# EAGLE design nabijecka_pb (EAGLE 7.1.0)
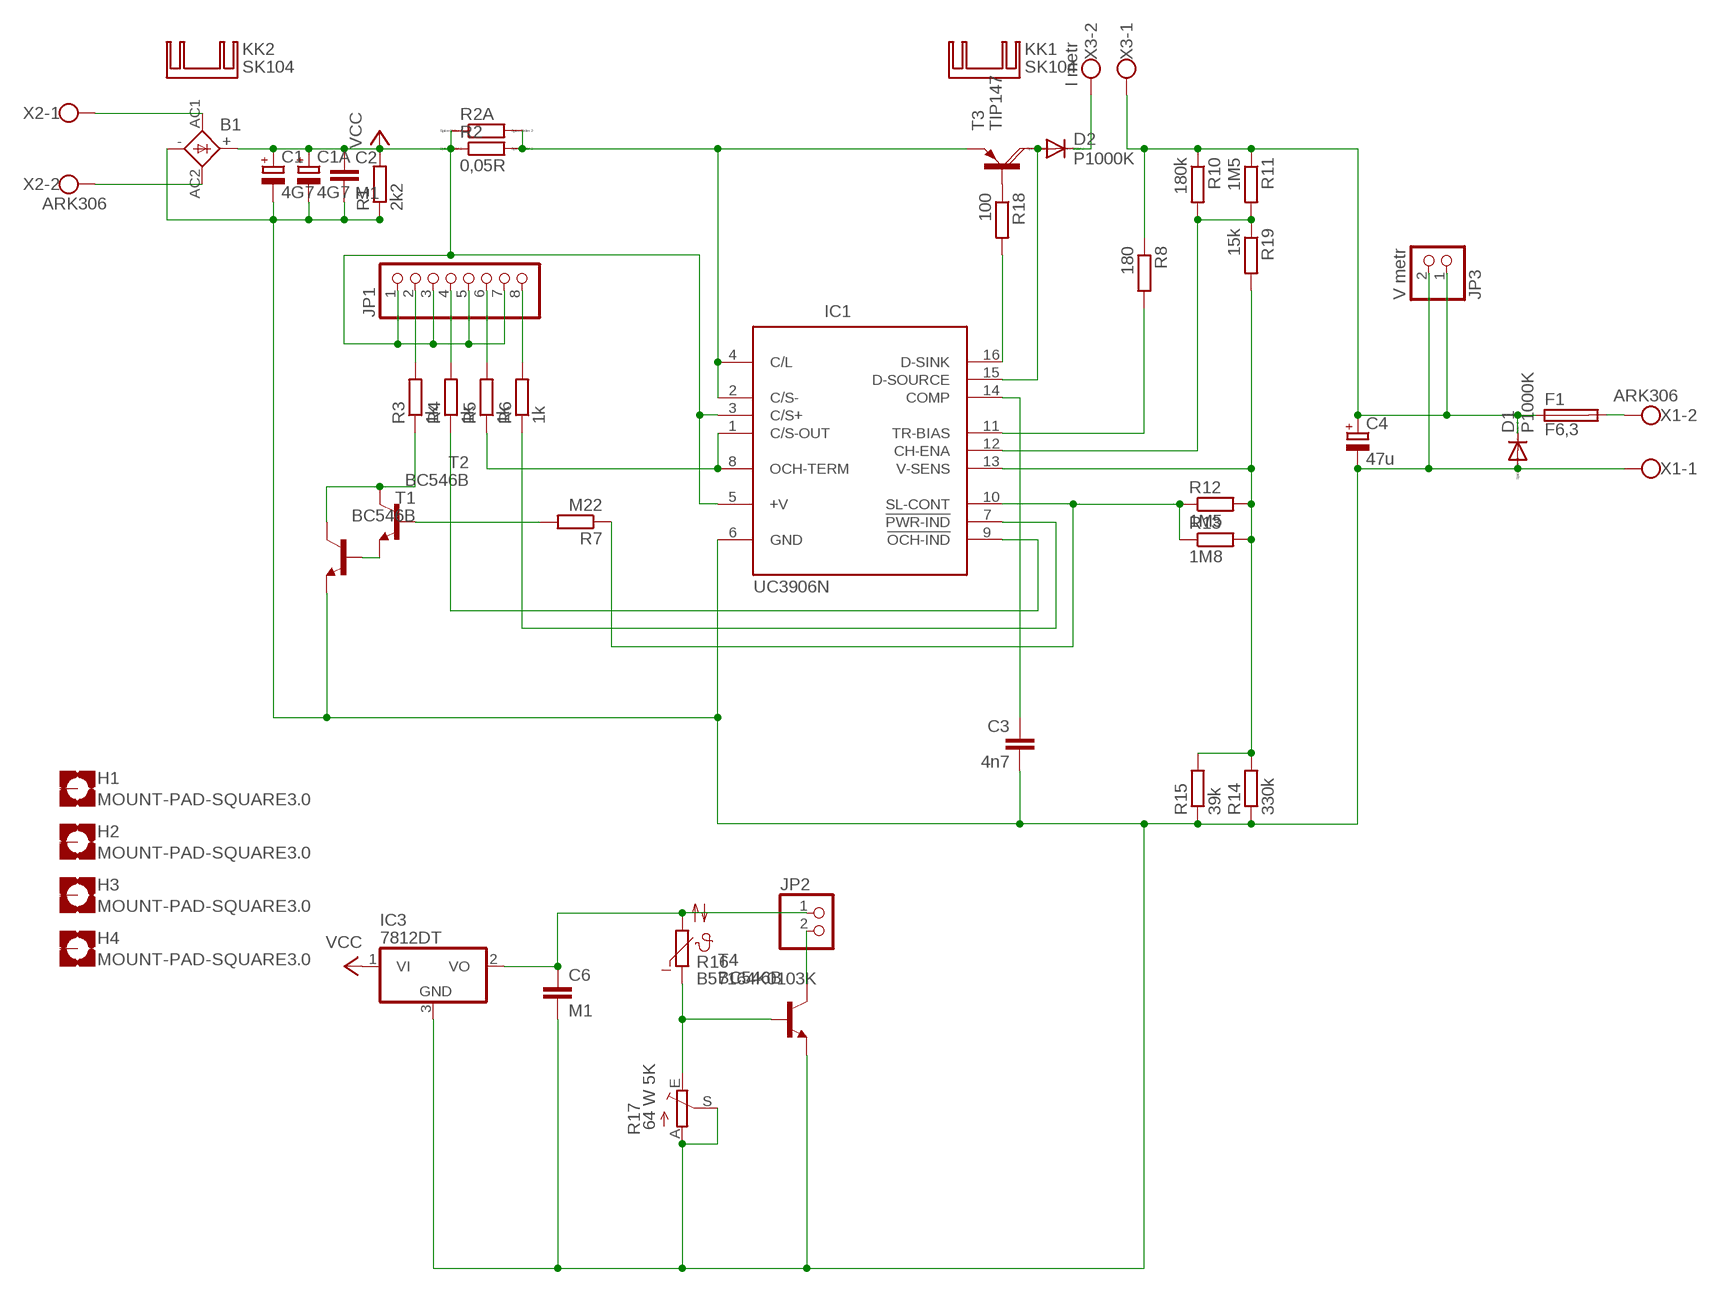
[diagram p0: schematic, sheet 1]

## Parts
B1  FB32  [FB32]
C1  4G7  CPOL-EUE7.5-18  [E7,5-18]
C1A  4G7  CPOL-EUE7.5-18  [E7,5-18]
C2  M1  C-EU050-045X075  [C050-045X075]
C3  4n7  C-EU050-045X075  [C050-045X075]
C4  47u  CPOL-EUE2.5-6  [E2,5-6]
C6  M1  C-EUC1206  [C1206]
D1  P1000K  P600  [P6-15]
D2  P1000K  P600  [P6-15]
F1  F6,3  FUSEF456  [F456]
H1  MOUNT-PAD-SQUARE3.0  [3,0-PAD-SQUARE]
H2  MOUNT-PAD-SQUARE3.0  [3,0-PAD-SQUARE]
H3  MOUNT-PAD-SQUARE3.0  [3,0-PAD-SQUARE]
H4  MOUNT-PAD-SQUARE3.0  [3,0-PAD-SQUARE]
IC1  UC3906N  [DIL16]
IC3  7812DT  [TO252]
JP1  PINHD-1X8  [1X08]
JP2  PINHD-1X2  [1X02]
JP3  V metr  PINHD-1X2  [1X02]
KK1  SK104  [SK104]
KK2  SK104  [SK104]
R1  2k2  R-EU_0207/10  [0207/10]
R2  0,05R  R-EU_0817_22  [P0817/22]
R2A  R-EU_0817_22  [P0817/22]
R3  1k  R-EU_0207/10  [0207/10]
R4  1k  R-EU_0207/10  [0207/10]
R5  1k  R-EU_0207/10  [0207/10]
R6  1k  R-EU_0207/10  [0207/10]
R7  M22  R-EU_0207/10  [0207/10]
R8  180  R-EU_0207/10  [0207/10]
R10  180k  R-EU_0207/10  [0207/10]
R11  1M5  R-EU_0207/10  [0207/10]
R12  1M5  R-EU_0207/10  [0207/10]
R13  1M8  R-EU_0207/10  [0207/10]
R14  330k  R-EU_0207/10  [0207/10]
R15  39k  R-EU_0207/10  [0207/10]
R16  B57164K0103K  NTC642-6  [P642]
R17  64 W 5K  TRIM_EU-S64W  [S64W]
R18  100  R-EU_0207/10  [0207/10]
R19  15k  R-EU_0207/10  [0207/10]
T1  BC546B  [TO92-EBC]
T2  BC546B  [TO92-EBC]
T3  TIP147  [SOT93]
T4  BC546B  [TO92-EBC]
X1  ARK306  W237-102  [W237-102]
X2  ARK306  W237-102  [W237-102]
X3  I metr  W237-102  [W237-102]

## Nets
N$1: B1.AC1 X2.1
N$2: B1.AC2 X2.2
N$3: F1.2 X1.2
N$4: IC1.2(C/S-) IC1.4(C/L) R2.2 R2A.2 T3.E
N$5: JP1.4 R4.2
N$6: JP1.2 R3.2
N$7: D2.A IC1.15(D-SOURCE) T3.C
N$8: JP1.6 R5.2
N$9: JP1.8 R6.2
N$10: R3.1 T1.C T2.C
N$11: R7.2 T2.B
N$12: IC1.7(!PWR-IND) R6.1
N$13: IC1.1(C/S-OUT) IC1.8(OCH-TERM) R5.1
N$14: IC1.9(!OCH-IND) R4.1
N$15: T1.B T2.E
N$16: IC1.10(SL-CONT) R7.1 R12.1 R13.1
N$17: R18.1 T3.B
N$18: C4.+ D1.C F1.1 JP3.1 R8.1 R10.1 R11.1 X3.1
N$19: D2.C X3.2
N$20: C3.1 IC1.14(COMP)
N$21: IC1.11(TR-BIAS) R8.2
N$23: IC1.12(CH-ENA) R10.2 R11.2 R19.1
N$24: IC1.13(V-SENS) R12.2 R13.2 R14.2 R15.2 R19.2
N$25: R16.1 R17.E T4.B
N$26: C6.1 IC3.2(VO) JP2.1 R16.2
N$28: B1.- C1.- C1A.- C2.2 C3.2 C4.- C6.2 D1.A IC1.6(GND) IC3.3(GND) JP3.2 R1.1 R14.1 R15.1 R17.A R17.S T1.E T4.E X1.1
N$29: IC1.16(D-SINK) R18.2
N$30: JP2.2 T4.C
VCC: B1.+ C1.+ C1A.+ C2.1 IC1.3(C/S+) IC1.5(+V) IC3.1(VI) JP1.1 JP1.3 JP1.5 JP1.7 R1.2 R2.1 R2A.1
Unconnected: H1.B3,0(MOUNT) H2.B3,0(MOUNT) H3.B3,0(MOUNT) H4.B3,0(MOUNT)

## Library data of the parts
B1 = rectifier:FB32: FAGOR RECTIFIER grid 1 x 10,2 x 7,5 mm
C1 C1A C4 = rcl:CPOL-EU: POLARIZED CAPACITOR, European symbol
C2 C3 C6 = rcl:C-EU: CAPACITOR, European symbol
D1 D2 = diode:P600: DIODE high voltage diode, silicon rectifier 1.0 A to 6.0 A, 50 V to 1300 V http://www.kosemi.com/product/diosr.html
F1 = fuse:FUSE: Fuse; OC_FARNELL: unknown; OC_NEWARK: unknown
H1-H4 = holes:MOUNT-PAD-SQUARE: MOUNTING PAD, square
IC1 = unitrode:UC3906: Sealed Lead-Acid Battery Charger
IC3 = linear:78*: Positive VOLTAGE REGULATOR Source: http://cache.national.com/ds/LM/LM78L05.pdf http://www.fairchildsemi.com/ds/LM/LM7805.pdf
JP1 = pinhead:PINHD-1X8: PIN HEADER
JP2 JP3 = pinhead:PINHD-1X2: PIN HEADER
KK1 KK2 = heatsink:SK104: HEATSINK manufacturer Fischer/distributor Buerklin
R1 R3-R8 R10-R15 R18 R19 = rcl:R-EU_: RESISTOR, European symbol
R2 R2A = resistor:R-EU_: RESISTOR, European symbol; SPICEPREFIX: R
R16 = ptc-ntc:NTC642-6: PHILIPS NTC; OC_FARNELL: unknown; OC_NEWARK: unknown
R17 = pot:TRIM_EU-: POTENTIOMETER
T1 T2 T4 = transistor-npn:BC546*: NPN Transistor
T3 = transistor-power:TIP147: PNP DARLINGTON TRANSISTOR
X1-X3 = con-wago-500:W237-102: WAGO SCREW CLAMP; MPN: 237-102; OC_FARNELL: unknown; OC_NEWARK: 70K9898

## Board
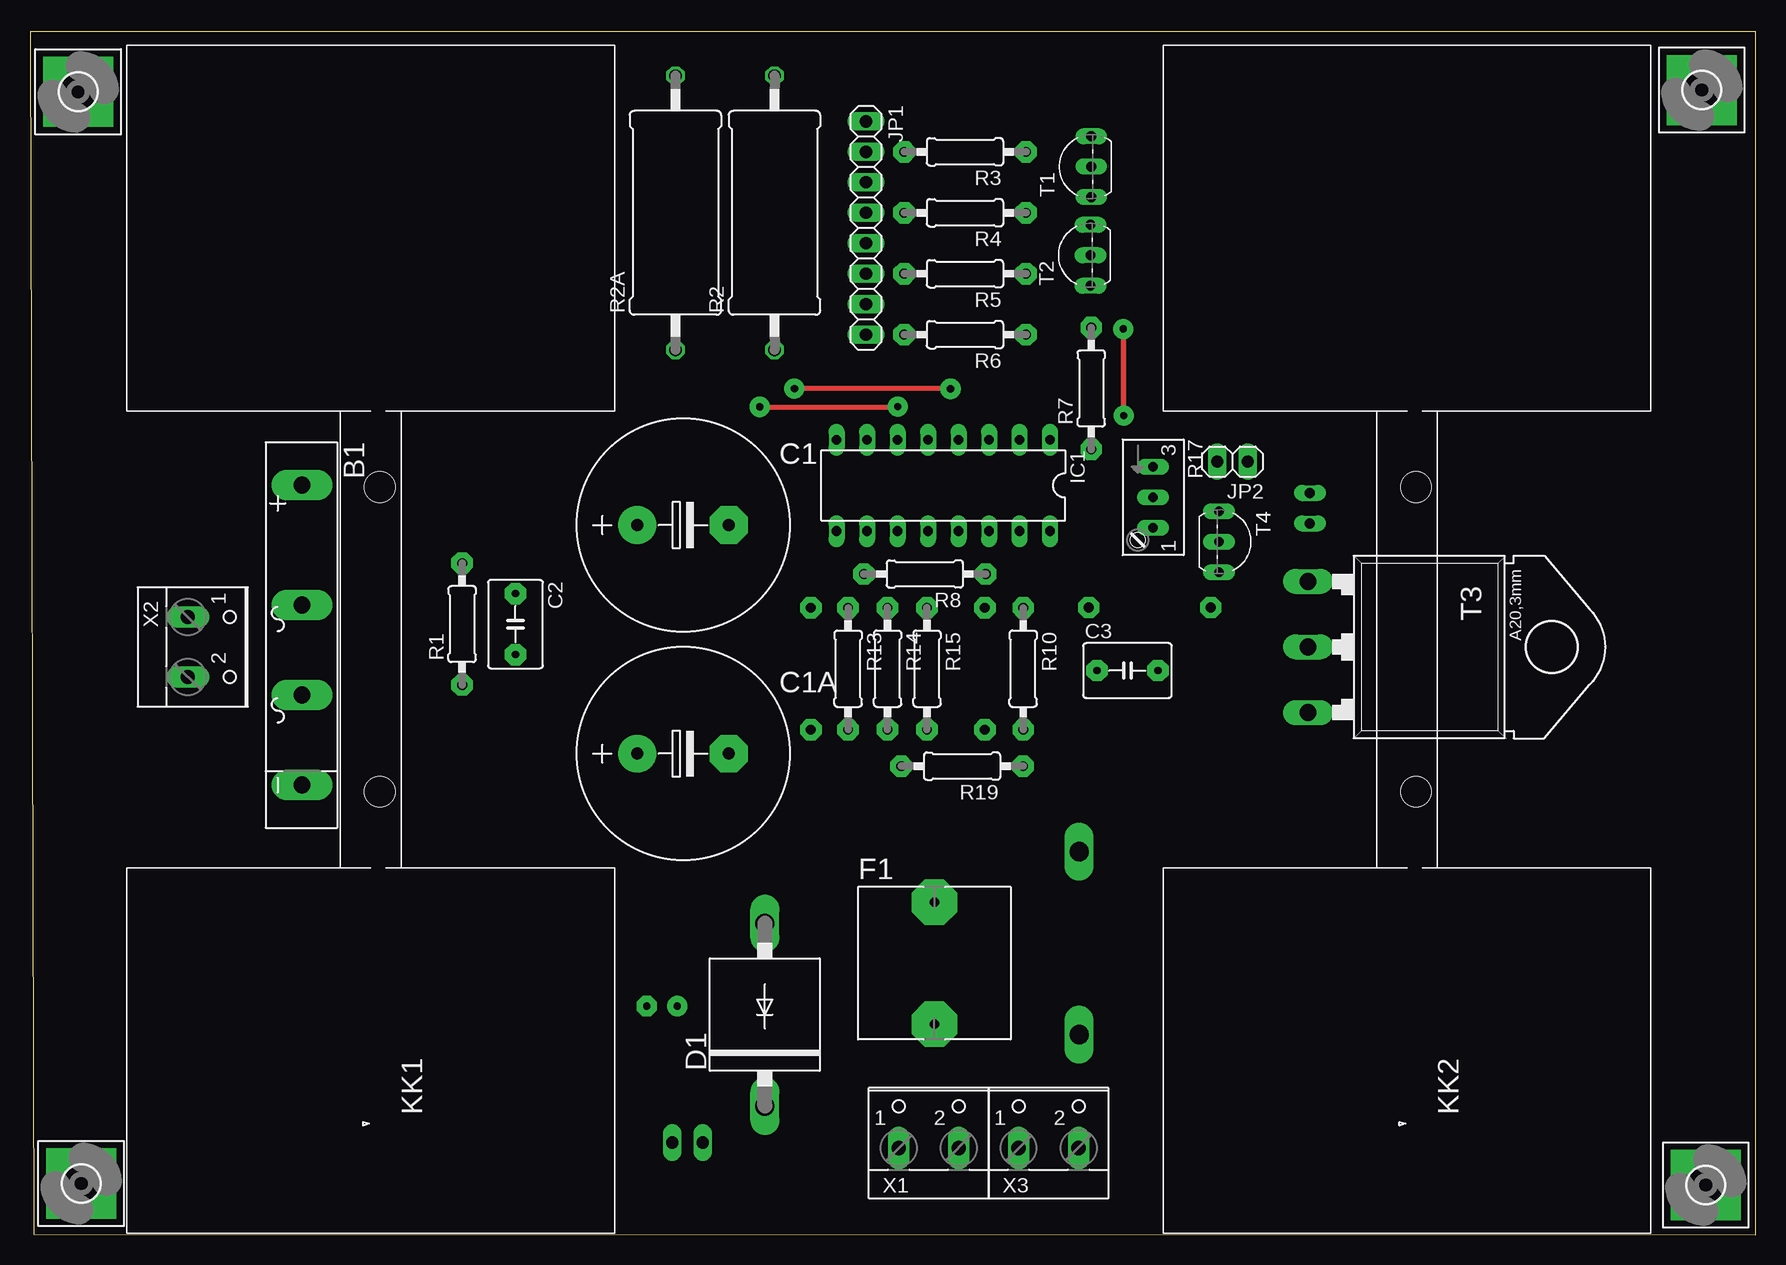
[diagram p1: board, top side]
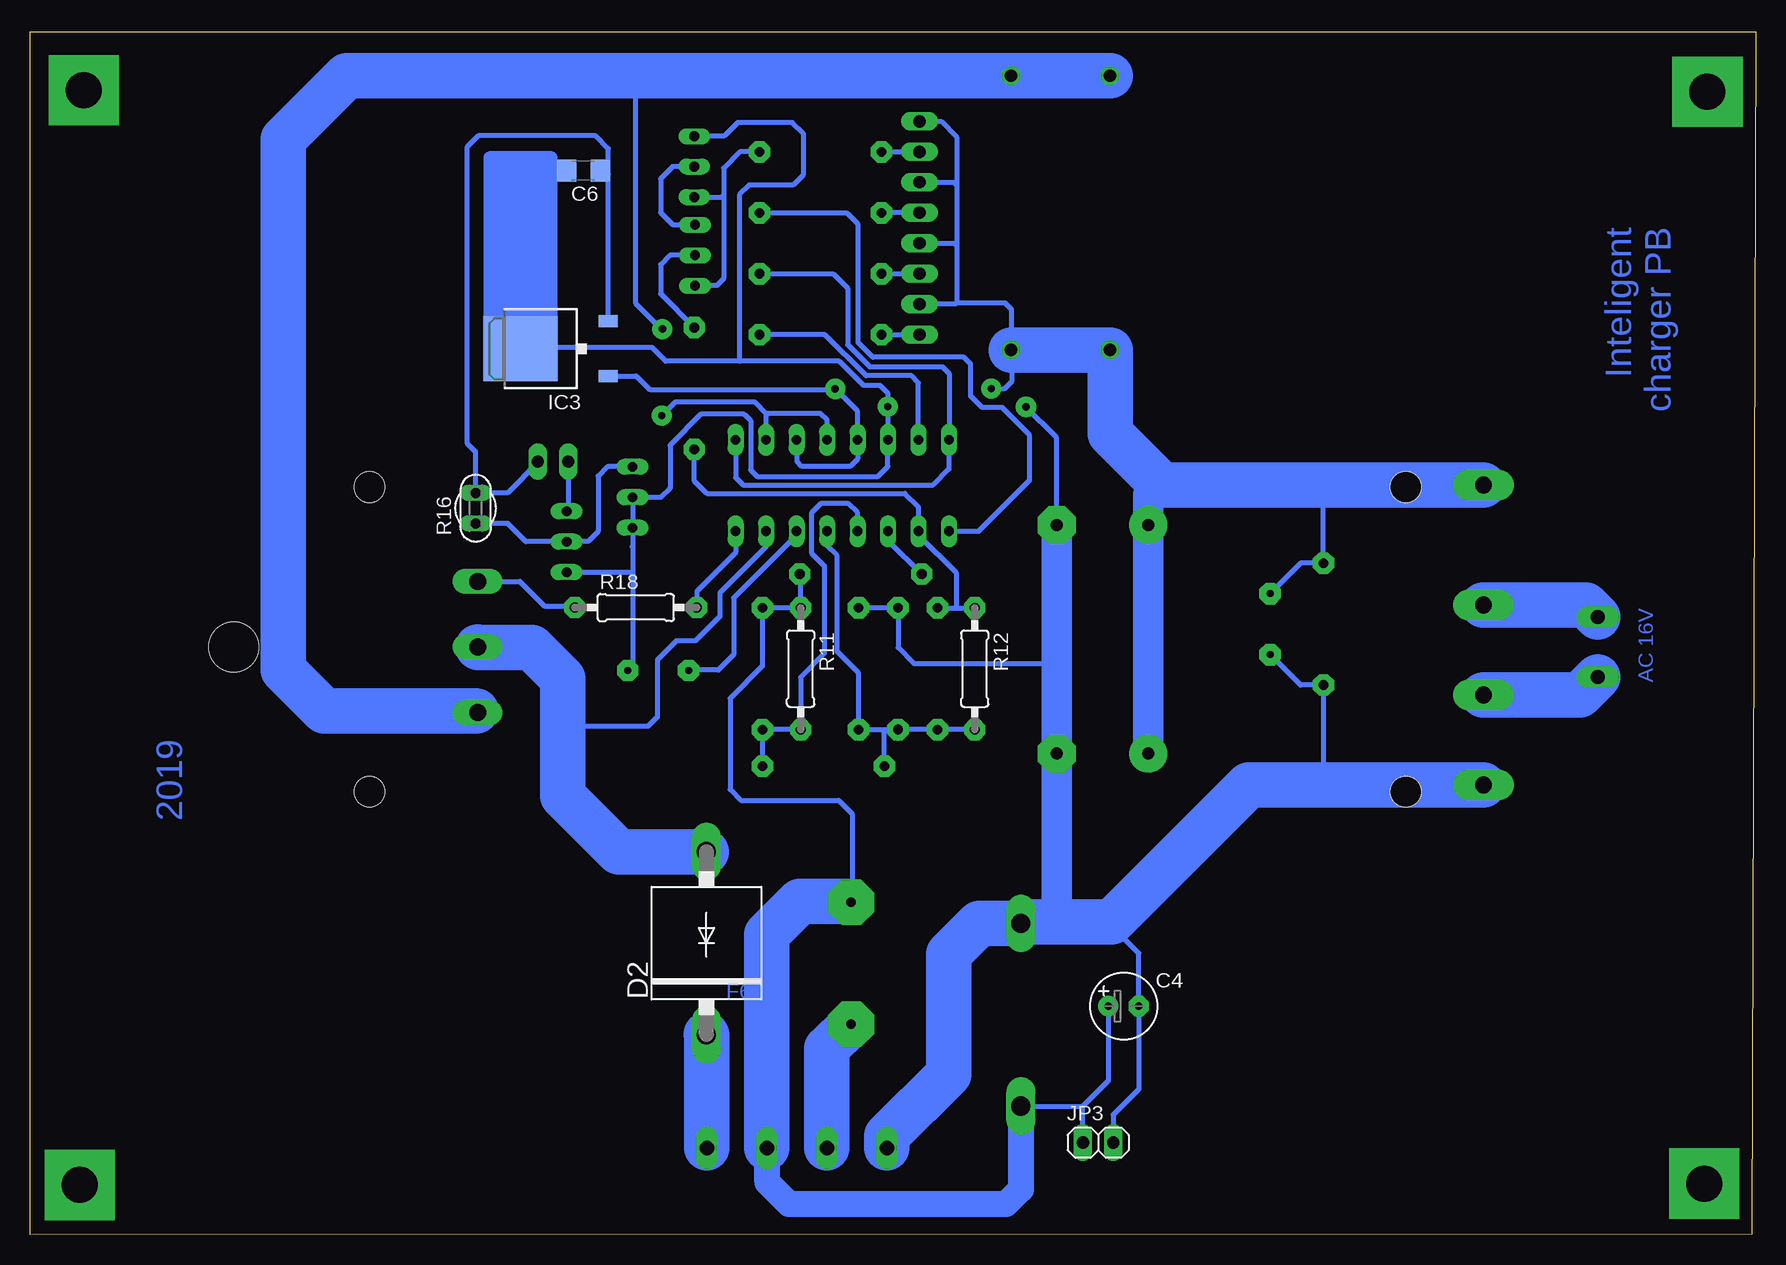
[diagram p2: board, bottom side, seen from below]

Size 143.8 x 100.31 mm. Coordinates in mm from the lower left corner, seen from the top.
Outline: 0.3,0.06 143.8,0 143.8,100.31 0,100.31 0.3,0.06
Copper layers (1*16): Top 0.035mm / dielectric 1.5mm / Bottom 0.035mm
Design rules "default": minimum track width 10mil, minimum drill 24mil, track to track 8mil, track to pad 8mil, pad to pad 8mil, via to via 8mil, smd to smd 8mil, copper to edge 40mil, drill to drill 8mil, minimum pad ring 10mil, minimum via ring 8mil, stop-mask expansion 4mil, vias tented up to drill 0mil, thermal gap 10mil

### Footprints (pad centres in the part's own frame; a part is rotated, then mirrored left to right if it is on the bottom)
FB32 = drill 1.397 pad 2.54 long: + -13.5,0; - 11.494,0; AC1 -3.492,0; AC2 4.001,0
E7,5-18 = drill 1.016 pad 3.15: + -3.81,0 | drill 1.016 pad 3.15 octagon: - 3.81,0
C050-045X075 = drill 0.6 pad 1.778 octagon: 1 -2.54,0; 2 2.54,0
E2,5-6 = drill 0.6 pad 1.676: + -1.27,0 | drill 0.6 pad 1.676 octagon: - 1.27,0
C1206 = smd 1.6 x 1.8: 1 -1.4,0; 2 1.4,0
P6-15 = drill 1.6 long: A 7.62,0; C -7.62,0
F456 = drill 0.8 pad 3.81 octagon: 1 0,5.08; 2 0,-5.08
3,0-PAD-SQUARE = drill 3 pad 5.842 square: B3,0 0,0
DIL16 = drill 0.813 long: 1 -8.89,-3.81; 2 -6.35,-3.81; 3 -3.81,-3.81; 4 -1.27,-3.81; 5 1.27,-3.81; 6 3.81,-3.81; 7 6.35,-3.81; 8 8.89,-3.81; 9 8.89,3.81; 10 6.35,3.81; 11 3.81,3.81; 12 1.27,3.81; 13 -1.27,3.81; 14 -3.81,3.81; 15 -6.35,3.81; 16 -8.89,3.81
TO252 = smd 1 x 1.6: 1 -2.28,-4.8; 2 2.28,-4.8 | smd 5.4 x 6.2: 3 0,2.5
1X08 = drill 1.016 long: 1 -8.89,0; 2 -6.35,0; 3 -3.81,0; 4 -1.27,0; 5 1.27,0; 6 3.81,0; 7 6.35,0; 8 8.89,0
1X02 = drill 1.016 long: 1 -1.27,0; 2 1.27,0
SK104 = hole 2.54: -12.7,-0.762; 12.7,-0.762
0207/10 = drill 0.813 pad 1.778 octagon: 1 -5.08,0; 2 5.08,0
P0817/22 = drill 1.016 octagon: 1 -11.43,0; 2 11.43,0
P642 = drill 0.813 long: 1 -1.27,0; 2 1.27,0
S64W = drill 0.813 long: A 2.54,1.27; E -2.54,1.27; S 0,1.27
TO92-EBC = drill 0.813 long: B 0,-1.27; C -2.54,-1.27; E 2.54,-1.27
SOT93 = drill 1.397 long: B -5.461,-10.16; C 0,-10.16; E 5.461,-10.16 | hole 4.115: 0,10.16
W237-102 = drill 1.194 long: 1 -2.5,-1.27; 2 2.5,-1.27

### Placement (x,y rotation side)
B1  22.68,49.02 270 top
C1  54.43,59.18 0 top
C1A  54.43,40.13 0 top
C2  40.46,50.92 270 top
C3  91.45,47.05 0 top
C4  52.67,19.08 0 bottom
C6  97.69,88.72 180 bottom
D1  61.23,18.36 90 top
D2  87.43,24.33 90 bottom
F1  75.37,22.65 0 top
H1  4.01,95.29 0 top
H2  4.26,4.28 0 top
H3  139.65,4.16 0 top
H4  139.31,95.45 0 top
IC1  76.11,62.48 180 top
IC3  100.41,73.88 90 bottom
JP1  69.67,83.94 270 top
JP2  100.21,64.47 180 top
JP3  54.79,7.7 0 bottom
KK1  28.39,49.65 90 top
KK2  114.75,49.65 90 top
R1  36.01,50.92 90 top
R2  62.05,85.21 90 top
R2A  53.79,85.21 90 top
R3  77.92,90.29 180 top
R4  77.92,85.21 180 top
R5  77.92,80.13 180 top
R6  77.92,75.05 180 top
R7  88.44,70.57 90 top
R8  74.57,55.1 180 top
R10  82.77,47.2 270 top
R11  79.57,47.2 270 bottom
R12  65.07,47.2 270 bottom
R13  68.17,47.2 270 top
R14  71.46,47.21 270 top
R15  74.75,47.21 270 top
R16  106.65,60.58 90 bottom
R17  92.32,61.5 270 top
R18  93.32,52.3 0 bottom
R19  77.67,39.08 180 top
T1  87.17,89.06 90 top
T2  87.1,81.68 90 top
T3  116.66,49.02 270 top
T4  100.35,57.79 270 top
X1  74.89,8.52 0 top
X2  14.42,49.02 270 top
X3  84.88,8.52 0 top

### Tracks (layer width: path | path; a pad name or v marks a point on that pad's centre or on a via)
N$1
  Bottom 3.81: B1.AC1 14.14,52.51 X2.1
N$2
  Bottom 3.81: B1.AC2 14.65,45.02 X2.2
N$3
  Bottom 3.81: X1.2 77.39,15.55 F1.2
N$4  (via drill 0.6 pad 1.68)
  Top 0.406: v91.15,68.3 91.15,75.47 v91.09,75.53
  Bottom 0.406: 122.66,65.59 122.71,65.54 | IC1.4 77.38,67.93 77.93,68.48 82.33,68.48 | IC1.2 82.46,68.35 82.33,68.48 | 122.65,67.67 122.71,67.73 | 122.57,68.48 122.71,68.62 | 82.33,68.48 82.43,68.48 83.36,69.42 90.03,69.42 v91.15,68.3 | 122.64,67.54 122.71,67.47 | v91.09,75.53 91.18,75.53 93.31,77.65 93.31,96.37 93.58,96.64
  Bottom 2.54: 106.6,43.66 T3.E
  Bottom 3.81: R2A.2 R2.2 93.58,96.64 117.42,96.64 122.71,91.36 122.71,68.62 122.71,67.73 122.71,67.47 122.71,65.54 122.71,47.08 119.28,43.66 106.6,43.66
N$5
  Bottom 0.406: JP1.4 R4.2
N$6
  Bottom 0.406: R3.2 JP1.2
N$7
  Bottom 0.406: IC1.15 82.46,57.38 86.31,53.53 86.31,51.56 88.35,49.52 89.95,49.52 91.52,47.95 91.52,43.18 92.3,42.39 99.05,42.39 99.39,42.05
  Bottom 3.81: D2.A 94.73,31.95 99.39,36.61 99.39,42.05 99.39,46.38 101.97,48.96 106.43,48.96 T3.C
N$8
  Bottom 0.406: R5.2 JP1.6
N$9
  Bottom 0.406: R6.2 JP1.8
N$10
  Bottom 0.406: R3.1 84.63,90.29 85.99,88.93 85.99,86.69 | 85.99,86.69 85.99,79.72 86.56,79.14 T2.C | T1.C 86.16,86.52 85.99,86.69
N$11
  Bottom 0.406: T2.B 90.48,81.68 91.25,80.91 91.25,78.46 R7.2
N$12
  Bottom 0.406: IC1.7 69.76,71.05 70.34,71.63 74.13,71.63 77.55,75.05 R6.1
N$13
  Bottom 0.406: IC1.1 84.99,66.29 84.99,63.14 84.36,62.52 68.54,62.52 67.22,63.83 IC1.8 67.19,66.32 67.19,71.81 67.76,72.37 73.83,72.37 75.67,74.22 75.67,78.93 76.88,80.13 R5.1
N$14
  Bottom 0.406: IC1.9 64.72,58.68 60.49,62.91 60.49,66.68 62.79,68.98 64.46,68.98 65.4,69.92 65.4,72.61 65.97,73.18 73.56,73.18 74.79,74.4 74.79,84.26 75.7,85.17 82.96,85.17 R4.1
N$15
  Bottom 0.406: T1.B 90.24,89.06 91.25,88.05 91.25,85.23 90.24,84.23 88.39,84.23 T2.E
N$16
  Bottom 0.406: 65.09,52.31 R12.1 | R13.1 66.68,52.28 | 66.68,52.28 R12.1 | R12.1 | 66.68,52.28 66.62,52.34 66.62,55.2 69.76,58.34 IC1.10 69.79,58.71 69.79,60.73 70.89,61.82 87.4,61.82 88.43,62.85 88.43,65.48 R7.1
N$17
  Bottom 0.406: T3.B 102.98,54.48 100.94,52.44 98.53,52.44 R18.1
N$18
  Bottom 0.406: D1.C 56.06,10.74 | R11.1 | R11.1 79.57,55.02 R8.1 | JP3.1 56.06,10.74 | 56.06,10.74 | F1.1 75.24,27.61 74.74,27.61 75.28,28.14 75.28,35.1 76.41,36.23 84.56,36.23 85.45,37.12 85.45,44.73 82.77,47.42 R10.1 R11.1 | C4.+ 53.94,12.86 56.06,10.74
  Bottom 2.184: D1.C 61.23,3.8 62.47,2.57 80.54,2.57 82.35,4.38 82.35,7.22 X3.1
  Bottom 3.81: X3.1 82.38,25.06 79.64,27.8 75.43,27.8 F1.1
N$19
  Bottom 3.81: X3.2 87.38,16.66 D2.C
N$20
  Bottom 0.406: IC1.14 79.92,58.36 85.16,53.12 85.16,48.37 86.43,47.1 88.87,47.1 C3.1
N$21
  Bottom 0.406: IC1.11 72.3,57.91 R8.2
N$23
  Bottom 0.406: IC1.12 74.84,60.21 75.59,60.96 77.9,60.96 78.69,60.17 78.69,56.87 77.59,55.77 77.59,48.51 79.58,46.51 79.58,42.13 R11.2 R10.2 82.75,42.11 R19.1
N$24
  Bottom 0.406: R12.2 R13.2 | R13.2 | R13.2 71.45,42.12 R14.2 | R14.2 | 72.81,42.13 R15.2 74.75,46.83 76.53,48.62 76.53,56.62 77.39,57.48 77.39,58.66 IC1.13 | 72.81,42.13 R14.2 | R19.2 72.59,41.91 72.81,42.13
N$25
  Bottom 0.406: R17.E 95.68,64.04 96.44,63.28 96.44,58.65 97.28,57.81 99.05,57.81 T4.B 102.48,57.79 104,59.31 R16.1
N$26
  Bottom 0.406: JP2.1 101.48,64.38 104,61.86 106.64,61.86 R16.2 106.69,61.88 106.69,65.32 107.39,66.03 107.39,90.67 106.44,91.62 96.66,91.62 95.61,90.57 95.61,88.42 | IC3.2 95.61,88.42 | C6.1 95.91,88.72 95.61,88.42
N$28  (via drill 0.6 pad 1.68)
  Top 0.406: v60.8,69.03 72.28,69.03 v72.31,69.06
  Bottom 0.406: 93.59,57.43 R17.A R17.S 91.22,61.5 90.43,62.28 90.46,62.31 90.46,65.84 87.88,68.42 84.3,68.42 83.75,67.87 83.75,63.79 83.2,63.24 73.14,63.24 72.31,64.07 72.31,66.28 IC1.6 v72.31,69.06 72.33,69.08 72.33,70.18 72.98,70.84 74.36,70.84 76.35,72.83 84.68,72.83 | 93.59,57.43 93.59,55.09 | 93.59,55.09 93.59,47.46 C3.2 | 93.63,57.39 93.59,57.43 | T4.E 93.74,55.25 93.59,55.09 | C1.- 58.23,66.47 v60.8,69.03 | 36.24,37.52 36.01,37.75 R1.1 37.91,45.84 C2.2 | 54.01,26.11 51.4,23.49 C4.- 51.4,12.16 53.53,10.02 53.53,7.71 JP3.2 | R15.1 R14.1 71.46,48.95 70.16,47.66 58.32,47.66 58.23,47.57 | 84.68,72.83 90.82,72.83 91.96,73.97 102.82,73.97 IC3.3 | 84.68,72.83 84.68,86.71 83.87,87.53 80.21,87.53 79.38,88.36 79.38,91.85 80.26,92.73 84.82,92.73 85.94,91.61 88.43,91.61 T1.E | C6.2 100.24,88.72 100.32,88.64
  Bottom 1.016: 102.82,73.97 100.35,73.97 100.35,76.02 100.32,76.02 100.32,88.64 100.32,89.83 105.51,89.83 105.51,73.84 100.98,73.84 100.98,89.29 104.73,89.29 104.73,76.3 101.9,76.3 101.9,88.86 103.85,88.86 103.85,76.7 102.84,76.7 102.84,88.57 101.67,88.57 101.67,73.87
  Bottom 2.54: 58.61,26.11 58.23,26.48 C1A.- 58.23,47.57 C1.-
  Bottom 3.81: B1.- 36.24,37.52 42.22,37.52 53.64,26.11 54.01,26.11 58.61,26.11 61.1,26.11 D1.A 61.25,25.97 64.71,25.97 67.25,23.43 67.25,13.4 72.39,8.26 X1.1
N$29
  Bottom 0.406: IC1.16 85,56.89 88.23,53.66 88.23,52.31 R18.2
N$30
  Bottom 0.406: JP2.2 98.94,60.47 T4.C
VCC  (via drill 0.6 pad 1.68)
  Top 0.406: v76.71,70.54 63.73,70.54 v63.7,70.57
  Bottom 0.406: 53.16,73.15 R2A.1 | 36.01,62.52 R1.2 37.91,56 C2.1 | v63.7,70.57 62.57,70.57 61.95,71.19 61.95,73.69 R2.1 62.02,73.81 62.02,77.16 62.57,77.71 66.58,77.71 | JP1.1 67.88,92.83 66.58,91.53 66.58,87.52 | 66.58,87.52 66.58,82.47 | 66.58,82.47 66.58,77.71 | 66.58,77.71 66.68,77.61 69.65,77.61 JP1.7 | JP1.3 66.81,87.75 66.58,87.52 | JP1.5 66.79,82.67 66.58,82.47 | IC3.1 93.28,71.6 92.16,70.49 76.76,70.49 v76.71,70.54 74.84,68.67 IC1.5 74.84,64.7 75.46,64.07 79.47,64.07 79.88,64.48 79.88,66.26 IC1.3
  Bottom 2.54: 49.51,62.52 49.66,62.67 50.62,61.72 C1.+ C1A.+
  Bottom 3.81: B1.+ 36.01,62.52 49.51,62.52 | 49.66,62.67 53.79,66.8 R2A.1 R2.1

### Text on the board
Bottom: Inteligent / charger PB | AC 16V | 2019 | F6,3A